# EAGLE design signal generator_PCB (EAGLE 9.6.2)
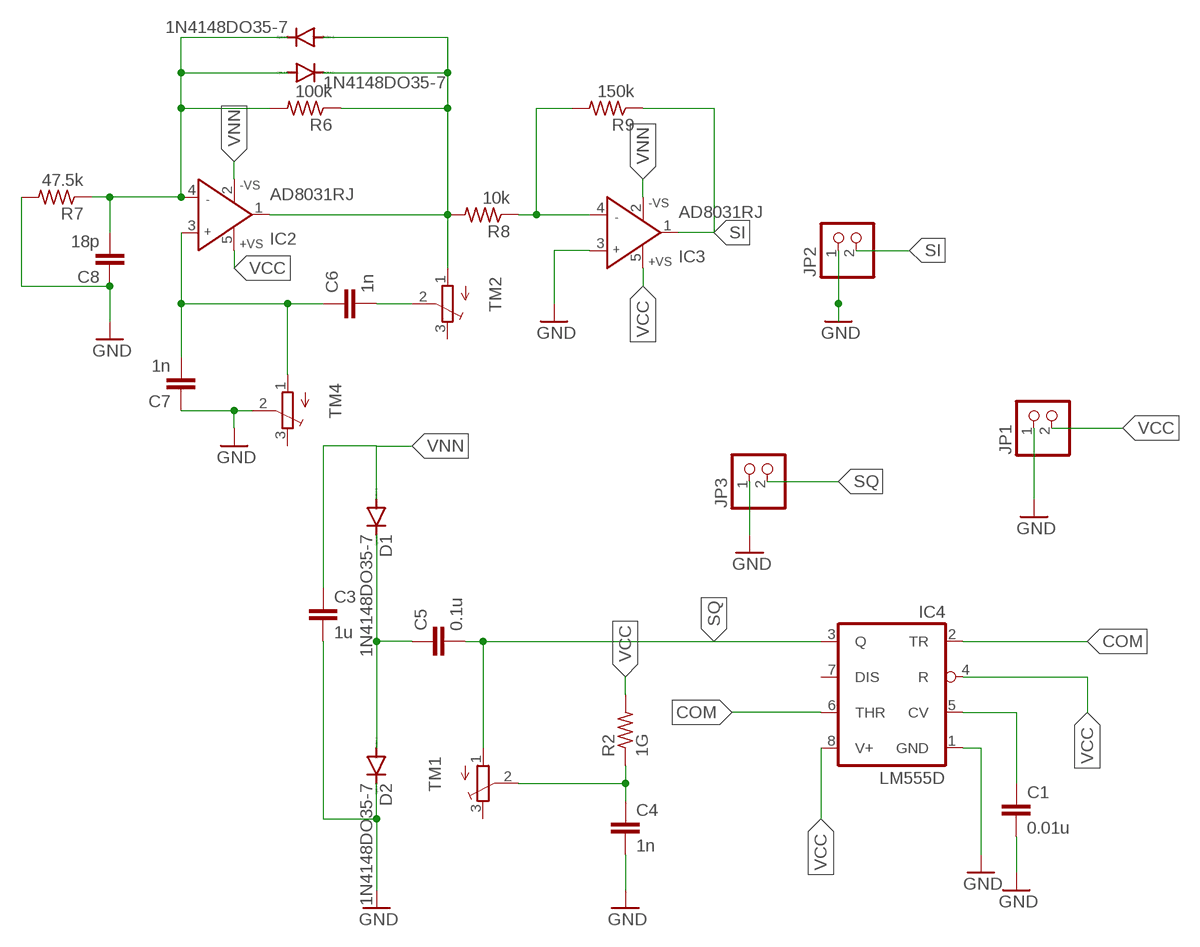
[diagram p0: schematic, sheet 1]

## Parts
C1  0.01u  C-EUC0805  [C0805]
C3  1u  C-EUC0805  [C0805]
C4  1n  C-EUC0805  [C0805]
C5  0.1u  C-EUC0805  [C0805]
C6  1n  C-EUC0805  [C0805]
C7  1n  C-EUC0805  [C0805]
C8  18p  C-EUC0805  [C0805]
D1  1N4148DO35-7  [DO35-7]
D2  1N4148DO35-7  [DO35-7]
D3  1N4148DO35-7  [DO35-7]
D4  1N4148DO35-7  [DO35-7]
IC2  AD8031RJ  [SOT23-5]
IC3  AD8031RJ  [SOT23-5]
IC4  LM555D  [SO08]
JP1  PINHD-1X2  [1X02]
JP2  PINHD-1X2  [1X02]
JP3  PINHD-1X2  [1X02]
R2  1G  R-US_M0805  [M0805]
R6  100k  R-US_M0805  [M0805]
R7  47.5k  R-US_M0805  [M0805]
R8  10k  R-US_M0805  [M0805]
R9  150k  R-US_M0805  [M0805]
TM1  TRIMPOTTC33X  [TC33X]
TM2  TRIMPOTTC33X  [TC33X]
TM4  TRIMPOTTC33X  [TC33X]

## Nets
COM: IC4.2(TR) IC4.6(THR)
GND: C1.2 C3.2 C4.2 C7.1 C8.1 D2.C IC3.3(IN+) IC4.1(GND) JP1.1 JP2.1 JP3.1 R7.2 TM4.2(S)
N$1: C1.1 IC4.5(CV)
N$2: C4.1 R2.1 TM1.2(S)
N$4: C5.1 D1.C D2.A
N$5: C6.2 TM2.2(S)
N$6: D3.C D4.A IC2.1(OUT) R6.1 R8.2 TM2.1(A)
N$8: C6.1 C7.2 IC2.3(IN+) TM4.1(A)
N$10: C8.2 D3.A D4.C IC2.4(IN-) R6.2 R7.1
N$11: IC3.4(IN-) R8.1 R9.2
SI: IC3.1(OUT) JP2.2 R9.1
SQ: C5.2 IC4.3(Q) JP3.2 TM1.1(A)
VCC: IC2.5(+VS) IC3.5(+VS) IC4.4(R) IC4.8(V+) JP1.2 R2.2
VNN: C3.1 D1.A IC2.2(-VS) IC3.2(-VS)
Unconnected: IC4.7(DIS) TM1.3(E) TM2.3(E) TM4.3(E)

## Library data of the parts
C1 C3-C8 = rcl:C-EU: CAPACITOR, European symbol; SPICEPREFIX: C
D1-D4 = diode:1N4148: DIODE high speed (Philips)
IC2 IC3 = analog-devices:AD8031: 2.7 V, 800 ?A, 80 MHz Rail-to-Rail I/O Amplifiers Source: http://www.analog.com/static/imported-files/data_sheets/AD8031_8032.pdf; MPN: AD8031ARTZ-REEL7; OC_FARNELL: 1660972; OC_NEWARK: 84R8399
IC4 = linear:*555: TIMER
JP1-JP3 = pinhead:PINHD-1X2: PIN HEADER
R2 R6-R9 = rcl:R-US_: RESISTOR, American symbol; SPICEPREFIX: R
TM1 TM2 TM4 = adafruit:TRIMPOT: SMT trimmer potentiometer part number TC33X http://www.ladyada.net/library/eagle

## Net classes
0 default: width 0.305 mm, drill 0.508 mm, clearance 0.254 mm

## Board
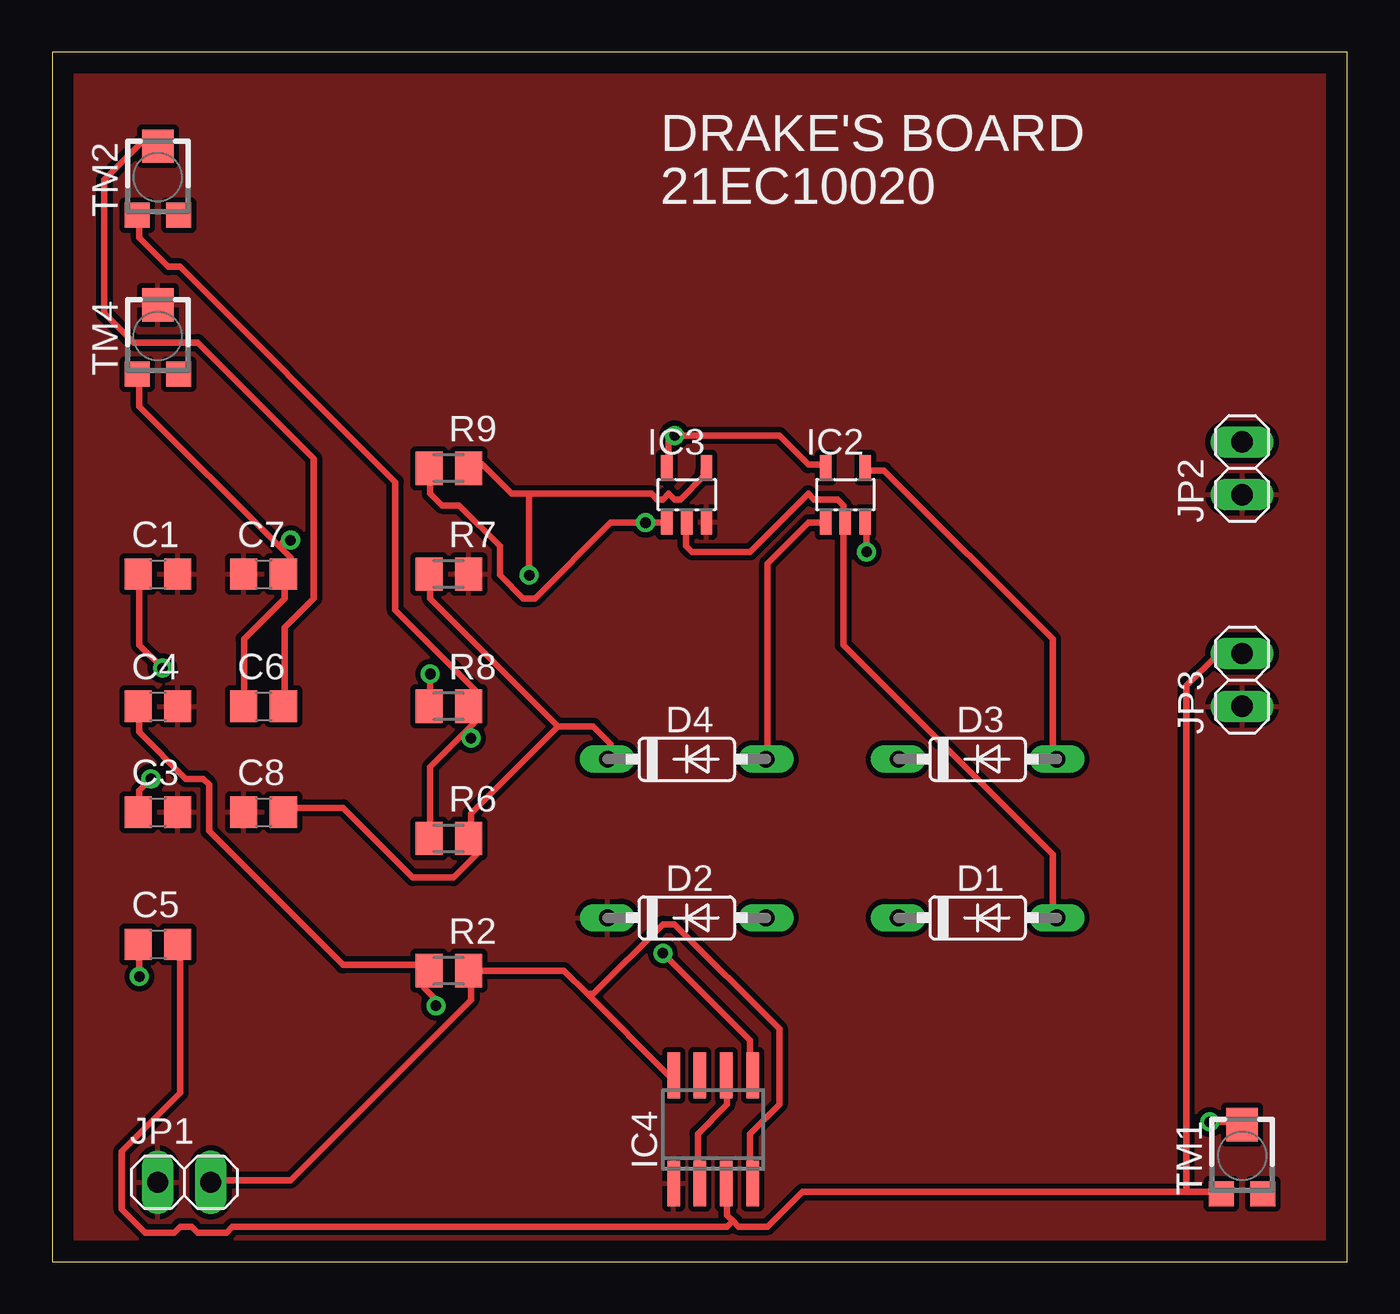
[diagram p1: board, top side]
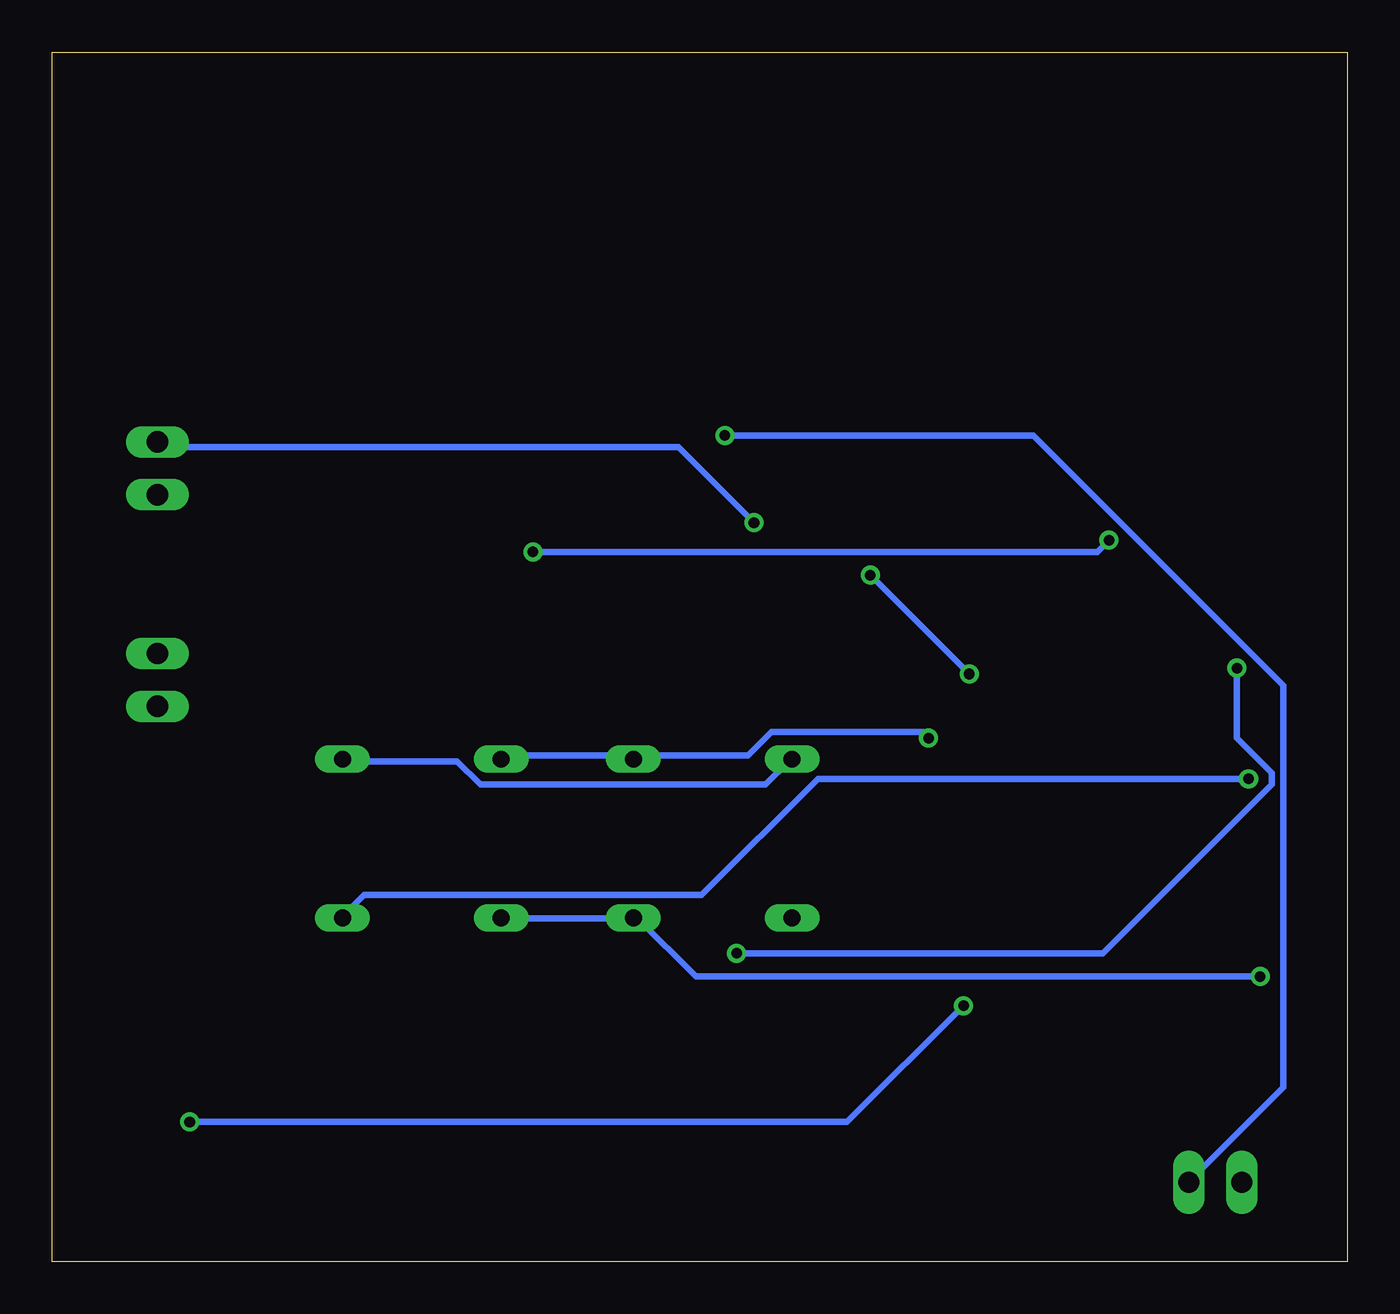
[diagram p2: board, bottom side, seen from below]

Size 62.21 x 58.09 mm. Coordinates in mm from the lower left corner, seen from the top.
Outline: 0,0 62.21,0 62.21,58.09 0,58.09 0,0
Copper layers (1*16): Top 0.035mm / dielectric 1.5mm / Bottom 0.035mm
Design rules "default *": minimum track width 6mil, minimum drill 0.35mm, track to track 6mil, track to pad 6mil, pad to pad 6mil, via to via 6mil, smd to smd 6mil, copper to edge 40mil, drill to drill 6mil, minimum pad ring 10mil, minimum via ring 8mil, stop-mask expansion 4mil, vias tented up to drill 0mil, thermal gap 10mil

### Footprints (pad centres in the part's own frame; a part is rotated, then mirrored left to right if it is on the bottom)
C0805 = smd 1.3 x 1.5: 1 -0.95,0; 2 0.95,0
DO35-7 = drill 0.813 long: A 3.81,0; C -3.81,0
SOT23-5 = smd 0.55 x 1.2: 1 -0.95,-1.3; 2 0,-1.3; 3 0.95,-1.3; 4 0.95,1.3; 5 -0.95,1.3
SO08 = smd 0.6 x 2.2: 1 -1.905,-2.6; 2 -0.635,-2.6; 3 0.635,-2.6; 4 1.905,-2.6; 5 1.905,2.6; 6 0.635,2.6; 7 -0.635,2.6; 8 -1.905,2.6
1X02 = drill 1.016 long: 1 -1.27,0; 2 1.27,0
M0805 = smd 1.3 x 1.6: 1 -0.95,0; 2 0.95,0
TC33X = smd 1.2 x 1.2: 1 -1,-1.825; 3 1,-1.825 | smd 1.5 x 1.6: 2 0,1.5

### Placement (x,y rotation side)
C1  5.08,33.02 0 top
C3  5.08,21.59 0 top
C4  5.08,26.67 0 top
C5  5.08,15.24 0 top
C6  10.16,26.67 0 top
C7  10.16,33.02 0 top
C8  10.16,21.59 0 top
D1  44.45,16.51 0 top
D2  30.48,16.51 0 top
D3  44.45,24.13 0 top
D4  30.48,24.13 0 top
IC2  38.1,36.83 0 top
IC3  30.48,36.83 0 top
IC4  31.75,6.35 0 top
JP1  6.35,3.81 0 top
JP2  57.15,38.1 90 top
JP3  57.15,27.94 90 top
R2  19.05,13.97 0 top
R6  19.05,20.32 0 top
R7  19.05,33.02 0 top
R8  19.05,26.67 0 top
R9  19.05,38.1 0 top
TM1  57.15,5.08 0 top
TM2  5.08,52.07 0 top
TM4  5.08,44.45 0 top

### Tracks (layer width: path | path; a pad name or v marks a point on that pad's centre or on a via)
COM
  Top 0.305: IC4.2 31.01,3.91 31.01,6.15 32.41,7.54 32.41,8.94 IC4.6
GND
  pour Top: -1.27,59.69 63.5,59.69 63.5,-1.27 -1.27,-1.27
N$1  (via drill 0.51)
  Top 0.305: v5.31,28.5 4.19,29.62 4.19,32.97 C1.1 | v29.34,14.81 33.53,10.62 33.53,9.22 IC4.5
  Bottom 0.305: v5.31,28.5 5.31,25.15 3.63,23.47 3.63,22.91 11.73,14.81 v29.34,14.81
N$2  (via drill 0.51)
  Top 0.305: C4.1 4.19,26.54 4.19,25.43 6.43,23.19 7.26,23.19 7.54,22.91 7.54,20.68 13.97,14.25 17.88,14.25 18.16,13.97 R2.1 17.88,13.97 17.88,13.13 18.44,12.57 v18.44,12.29 | v55.6,6.71 57,6.71 TM1.2
  Bottom 0.305: v55.6,6.71 24.03,6.71 v18.44,12.29
N$4  (via drill 0.51)
  Top 0.305: v4.19,13.69 4.19,15.09 C5.1
  Bottom 0.305: v4.19,13.69 31.29,13.69 34.09,16.48 D2.A 34.37,16.48 40.51,16.48 D1.C
N$5
  Top 0.305: C6.2 11.18,26.82 11.18,30.45 12.57,31.85 12.57,38.56 6.99,44.15 3.91,44.15 2.52,45.54 2.52,51.97 4.47,53.92 4.75,53.92 5.03,53.65 TM2.2
N$6  (via drill 0.51)
  Top 0.305: IC2.1 36.88,35.48 36.32,35.48 34.37,33.53 34.37,24.31 D4.A | TM2.1 4.19,50.01 4.19,49.17 5.59,47.78 6.15,47.78 16.48,37.44 16.48,31.29 20.4,27.38 20.4,27.1 20.12,26.82 R8.2 20.12,26.54 20.4,26.26 20.4,25.98 19.84,25.43 | 19.84,25.43 18.16,23.75 18.16,20.4 R6.1 | 19.84,25.43 v20.12,25.15
  Bottom 0.305: D3.C 40.51,24.31 34.37,24.31 D4.A 34.09,24.31 28.78,24.31 27.66,25.43 20.4,25.43 v20.12,25.15
N$8  (via drill 0.51)
  Top 0.305: 10.9,34.37 11.46,33.81 11.46,33.53 11.18,33.25 C7.2 11.18,32.97 11.18,31.85 9.22,29.9 9.22,26.82 C6.1 | 10.9,34.37 4.19,41.07 4.19,42.47 TM4.1 | v39.12,34.09 39.12,35.48 IC2.3 | v11.46,34.65 11.18,34.65 10.9,34.37
  Bottom 0.305: v39.12,34.09 12.01,34.09 v11.46,34.65
N$10
  Top 0.305: IC2.4 39.12,38 39.95,38 48.06,29.9 48.06,24.31 D3.A | C8.2 11.18,21.79 13.97,21.79 17.32,18.44 19.28,18.44 20.4,19.56 20.4,19.84 20.12,20.12 R6.2 20.12,20.4 20.12,21.51 24.31,25.7 | 24.31,25.7 18.16,31.85 18.16,32.97 R7.1 | 24.31,25.7 25.98,25.7 26.82,24.87 26.82,24.31 D4.C
  Bottom 0.305: D3.A 48.06,24.03 42.75,24.03 41.63,22.91 27.94,22.91 26.82,24.03 D4.C
N$11  (via drill 0.51)
  Top 0.305: 22.91,36.88 22.07,36.88 20.68,38.28 20.12,38.28 R9.2 | 22.91,36.88 28.78,36.88 29.06,36.6 29.34,36.6 29.62,36.88 29.9,36.6 30.18,36.6 31.29,37.72 31.29,38 IC3.4 | v18.16,28.22 18.16,26.82 R8.1 | 22.91,36.88 v22.91,32.97
  Bottom 0.305: v22.91,32.97 v18.16,28.22
SI  (via drill 0.51)
  Top 0.305: IC3.1 29.34,35.48 v28.5,35.48 26.82,35.48 23.19,31.85 22.63,31.85 21.51,32.97 21.51,34.37 19.56,36.32 18.72,36.32 18.16,36.88 18.16,38 R9.1
  Bottom 0.305: v28.5,35.48 32.13,39.12 57,39.12 JP2.2
SQ
  Top 0.305: 54.48,3.35 36.04,3.35 34.37,1.68 32.97,1.68 32.69,1.96 | 54.48,3.35 55.88,3.35 TM1.1 | 32.69,1.96 32.41,2.23 32.41,3.63 IC4.3 | 32.69,1.96 32.41,1.68 8.66,1.68 8.38,1.4 6.99,1.4 6.71,1.68 6.15,1.68 5.87,1.4 4.47,1.4 3.35,2.52 3.35,5.31 6.15,8.1 6.15,15.09 C5.2 | 54.48,3.35 54.48,27.66 55.88,29.06 57,29.06 JP3.2
VCC  (via drill 0.51)
  Top 0.305: IC3.5 29.62,38.28 29.62,39.4 v29.9,39.67 34.92,39.67 36.32,38.28 36.88,38.28 IC2.5 | 20.12,13.97 24.59,13.97 25.7,12.85 | 25.7,12.85 29.62,8.94 IC4.8 | 20.12,13.97 20.12,12.57 11.46,3.91 7.82,3.91 JP1.2 | 20.12,13.97 R2.2 | 25.7,12.85 25.98,12.85 29.34,16.2 29.9,16.2 34.92,11.18 34.92,7.54 33.53,6.15 33.53,3.91 IC4.4
  Bottom 0.305: v29.9,39.67 15.09,39.67 3.07,27.66 3.07,8.38 7.54,3.91 JP1.2
VNN  (via drill 0.51)
  Top 0.305: IC3.2 30.45,35.48 30.45,34.37 30.73,34.09 33.53,34.09 36.32,36.88 36.6,36.6 37.72,36.6 38,36.32 38,35.76 IC2.2 38,35.48 38,29.62 48.06,19.56 48.06,16.76 D1.A | v4.75,23.19 4.19,22.63 4.19,21.79 C3.1
  Bottom 0.305: v4.75,23.19 25.43,23.19 31.01,17.6 47.22,17.6 48.06,16.76 D1.A

### Text on the board
tPlace: DRAKE'S BOARD | 21EC10020